# Altium project Smart Motor Switch.PrjPcb
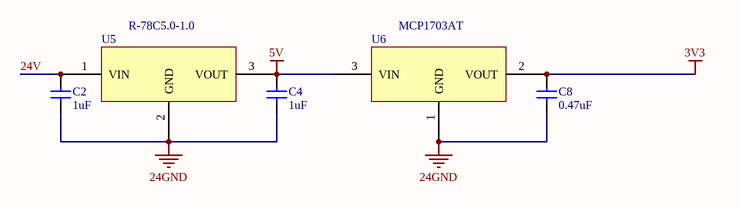
[diagram p0: power.SchDoc]
2 sheets, 53 parts. Net scope: global (net labels, ports and power ports of the same name join across sheets).
Board files: Smart Motor Switch.PcbDoc, SmartMotorSwitch_Panel.PcbDoc
Sheets:
  power.SchDoc
  CPU.SchDoc

## Sheet power.SchDoc
size A

### Parts
C2  value 1uF  [CAPC1206]  (hidden comment: Cap)
C4  value 1uF  [CAPC1206]  (hidden comment: Cap)
C8  value 0.47uF  [CAPC0603]  (hidden comment: Cap)
U5  R-78C5.0-1.0  [R-78C5.0-1.0]
U6  MCP1703AT  [MCP1703AT-xx02EDB]

### Nets
3V3: C8.1(A) U6.2(VOUT)
5V: C4.1(A) U5.3(VOUT) U6.3(VIN)
24GND: C2.2(B) C4.2(B) C8.2(B) U5.2(GND) U6.1(GND)
24V: C2.1(A) U5.1(VIN)

### Library data of the parts
U5 = R-78C5.0-1.0: CONV DC/DC 1A 5V OUT SIP VERT; Supplier 1: Digi-Key; Supplier Part Number 1: 945-1395-5-ND
U6 = MCP1703AT: 250 mA, 16V, Low Quiescent Current LDO Regulator; Supplier 1: Digi-Key; Supplier Part Number 1: MCP1703AT-3302E/CBCT-ND
C2 C4 C8 = Cap: Supplier 1: Digi-Key; Supplier Part Number 1: 1276-1000-1-ND

## Sheet CPU.SchDoc
size A
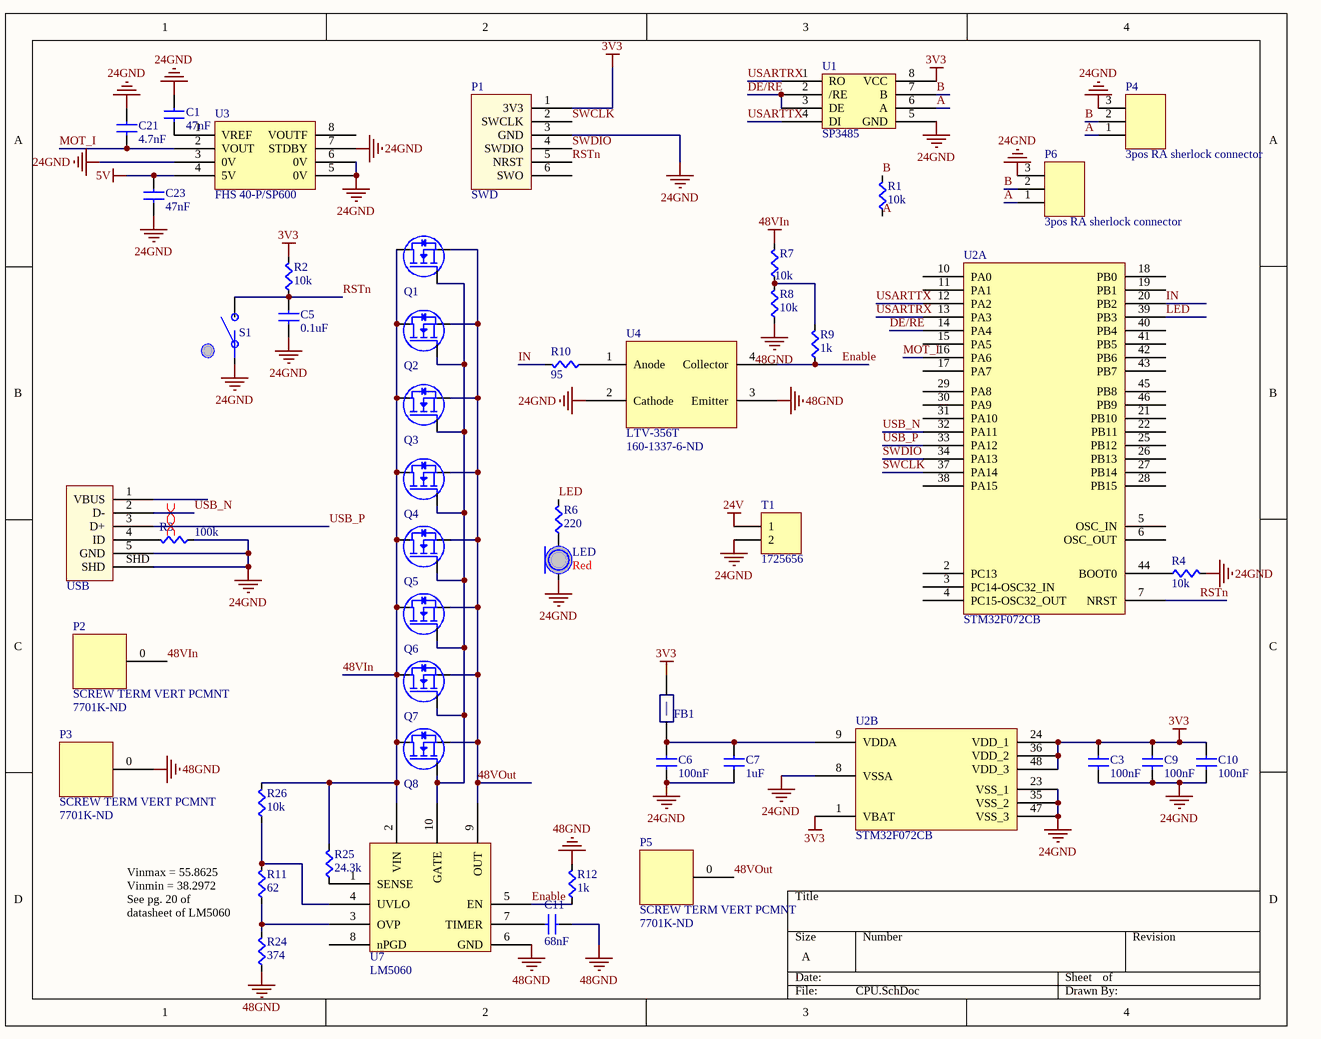
[diagram p1: CPU.SchDoc]

### Parts
C1  value 47nF  [CAPC0603]  (hidden comment: Cap)
C3  value 100nF  [CAPC0603]  (hidden comment: Cap)
C5  value 0.1uF  [CAPC0603]  (hidden comment: Cap)
C6  value 100nF  [CAPC0603]  (hidden comment: Cap)
C7  value 1uF  [CAPC0603]  (hidden comment: Cap)
C9  value 100nF  [CAPC0603]  (hidden comment: Cap)
C10  value 100nF  [CAPC0603]  (hidden comment: Cap)
C11  value 68nF  [CAPC0603]  (hidden comment: Cap)
C21  value 4.7nF  [CAPC0603]  (hidden comment: Cap)
C23  value 47nF  [CAPC0603]  (hidden comment: Cap)
FB1  FBead  [RES0603]  (value not drawn)
LED  Color: Red  [LED0603]  (hidden comment: LED)
P1  SWD  [SWD_STM32]
P2  SCREW TERM VERT PCMNT  Supplier Part Number 1: 7701K-ND  [SCREW TERM SINGLE VERT]
P3  SCREW TERM VERT PCMNT  Supplier Part Number 1: 7701K-ND  [SCREW TERM SINGLE VERT]
P4  3pos RA sherlock connector  [MOLEX-HDR-1X3-SHERLOCK-RA]
P5  SCREW TERM VERT PCMNT  Supplier Part Number 1: 7701K-ND  [SCREW TERM SINGLE VERT]
P6  3pos RA sherlock connector  [MOLEX-HDR-1X3-SHERLOCK-RA]
Q1  CSD19502Q5B  [CSD19502Q5B]  (value not drawn)
Q2  CSD19502Q5B  [CSD19502Q5B]  (value not drawn)
Q3  CSD19502Q5B  [CSD19502Q5B]  (value not drawn)
Q4  CSD19502Q5B  [CSD19502Q5B]  (value not drawn)
Q5  CSD19502Q5B  [CSD19502Q5B]  (value not drawn)
Q6  CSD19502Q5B  [CSD19502Q5B]  (value not drawn)
Q7  CSD19502Q5B  [CSD19502Q5B]  (value not drawn)
Q8  CSD19502Q5B  [CSD19502Q5B]  (value not drawn)
R1  value 10k  [RES0603]  (hidden comment: Res)
R2  value 10k  [RES0603]  (hidden comment: Res)
R3  value 100k  [RES0603]  (hidden comment: Res)
R4  value 10k  [RES0603]  (hidden comment: Res)
R6  value 220  [RES0603]  (hidden comment: Res)
R7  value 10k  [RES0603]  (hidden comment: Res)
R8  value 10k  [RES0603]  (hidden comment: Res)
R9  value 1k  [RES0603]  (hidden comment: Res)
R10  value 95  [RES0603]  (hidden comment: Res)
R11  value 62  [RES0603]  (hidden comment: Res)
R12  value 1k  [RES0603]  (hidden comment: Res)
R24  value 374  [RES0603]  (hidden comment: Res)
R25  value 24.3k  [RES0603]  (hidden comment: Res)
R26  value 10k  [RES0603]  (hidden comment: Res)
S1  Button  [PTS645xxxxSMTR92]  (value not drawn)
T1  1725656  [1725656]
U1  SP3485  [SP3485]
U2  STM32F072CB  [STM32F072CB]  (parts A,B of 2)
U3  FHS 40-P/SP600  [FHS 40-P/SP600]
U4  LTV-356T  Supplier Part Number 1: 160-1337-6-ND  [LTV-356T]
U7  LM5060  [LM5060]
USB  USB Micro  [10118192-0001LF]  (value not drawn)

### Nets
3V3: C3.1(A) C9.1(A) C10.1(A) FB1.2(B) P1.1(3V3) R2.1(A) U1.8(VCC) U2.1(VBAT) U2.24(VDD_1) U2.36(VDD_2) U2.48(VDD_3)
5V: C23.1(A) U3.4(5V)
24GND: C1.1(A) C3.2(B) C5.2(B) C6.2(B) C7.2(B) C9.2(B) C10.2(B) C21.2(B) C23.2(B) LED.C P1.3(GND) P4.3 P6.3 R3.2(B) R4.1(A) S1.A T1.2 U1.5(GND) U2.8(VSSA) U2.23(VSS_1) U2.35(VSS_2) U2.47(VSS_3) U3.3(0V) U3.5(0V) U3.6(0V) U3.7(STDBY) U4.2(Cathode) USB.5(GND) USB.SHD
24V: T1.1
48GND: C11.2(B) P3.0 R8.2(B) R12.1(A) R24.2(B) U4.3(Emitter) U7.6(GND)
48VIn: P2.0 Q1.D Q2.D Q3.D Q4.D Q5.D Q6.D Q7.D Q8.D R7.1(A) R25.1(A) R26.1(A) U7.2(VIN)
48VOut: P5.0 Q1.S Q2.S Q3.S Q4.S Q5.S Q6.S Q7.S Q8.S U7.9(OUT)
A: P4.1 P6.1 R1.2(B) U1.6(A)
B: P4.2 P6.2 R1.1(A) U1.7(B)
DE/RE: U1.2(/RE) U1.3(DE) U2.14(PA4)
Enable: R9.2(B) R12.2(B) U4.4(Collector) U7.5(EN)
IN: R10.1(A) U2.20(PB2)
LED: R6.1(A) U2.39(PB3)
MOT_I: C21.1(A) U2.16(PA6) U3.2(VOUT)
RSTn: C5.1(A) P1.5(NRST) R2.2(B) S1.B U2.7(NRST)
SWCLK: P1.2(SWCLK) U2.37(PA14)
SWDIO: P1.4(SWDIO) U2.34(PA13)
USARTRX: U1.1(RO) U2.13(PA3)
USARTTX: U1.4(DI) U2.12(PA2)
USB_N: U2.32(PA11) USB.2(D-)
USB_P: U2.33(PA12) USB.3(D+)
NetC1_2: C1.2(B) U3.1(VREF)
NetC6_1: C6.1(A) C7.1(A) FB1.1(A) U2.9(VDDA)
NetC11_1: C11.1(A) U7.7(TIMER)
NetLED_A: LED.A R6.2(B)
NetQ1_G: Q1.G Q2.G Q3.G Q4.G Q5.G Q6.G Q7.G Q8.G U7.10(GATE)
NetR3_1: R3.1(A) USB.4(ID)
NetR4_2: R4.2(B) U2.44(BOOT0)
NetR7_2: R7.2(B) R8.1(A) R9.1(A)
NetR10_2: R10.2(B) U4.1(Anode)
NetR11_1: R11.1(A) R26.2(B) U7.4(UVLO)
NetR11_2: R11.2(B) R24.1(A) U7.3(OVP)
NetR25_2: R25.2(B) U7.1(SENSE)

Not connected (* = marked no-connect by the designer): P1 6(SWO); U2 2(PC13) 3(PC14-OSC32_IN) 4(PC15-OSC32_OUT) 5(OSC_IN) 6(OSC_OUT) 10(PA0) 11(PA1) 15(PA5) 17(PA7) 18(PB0) 19(PB1) 21(PB10) 22(PB11) 25(PB12) 26(PB13) 27(PB14) 28(PB15) 29(PA8) 30(PA9) 31(PA10) 38(PA15) 40(PB4) 41(PB5) 42(PB6) 43(PB7) 45(PB8) 46(PB9); U3 8(VOUTF); U7 8(nPGD); USB 1(VBUS)

### Layout directives
differential pair: USB_N, USB_P

### Notes on the sheet
- Vinmax = 55.8625
  Vinmin = 38.2972
  See pg. 20 of datasheet of LM5060

### Library data of the parts
FB1 = FBead: Ferrite Bead; Supplier 1: Digi-Key; Supplier Part Number 1: 445-2988-1-ND
P1 = SWD_STM32: SWD connector matching the pinout on STM Discovery Boards
P2 P3 P5 = SCREW TERM VERT PCMNT: Keystone Electronics 7701; Supplier 1: Digi-Key
P4 P6 = MOLEX-HDR-1x3-SHERLOCK_RA: Header, Molex, 2mm Pitch Sherlock Header, Single Row, Right Angle 3 Circuits, Length 3.3mm; Manufacturer Part Number: 35363-0360; Manufacturer: Molex Connector Corporation; Supplier Part Number 1: WM18932-ND; Supplier 1: Digi-Key
Q1-Q8 = CSD19502Q5B: NEXFET Power MOSFET; Supplier 1: Digi-Key; Supplier Part Number 1: 296-37194-1-ND
S1 = Button: SPST Button; Supplier 1: Digi-Key; Supplier Part Number 1: CKN9087CT-ND
T1 = 1725656: CONN TERM BLOCK 2.54MM 2POS; Supplier 1: Digi-Key; Supplier Part Number 1: 277-1273-ND
U1 = SP3485: IC TXRX RS485 HALF DUPLEX 8NSOIC; Supplier 1: Digi-Key; Supplier Part Number 1: 1016-1817-1-ND
U2 = STM32F072CB: MCU 32BIT 128KB FLASH 48LQFP; Supplier 1: Digi-Key; Supplier Part Number 1: 497-14645-ND
U4 = LTV-356T: OPTOISOLATOR 3.75KV TRANS 4-SOP; Supplier 1: Digi-Key
U7 = LM5060: Hotswap Controller; Supplier 1: Digi-Key; Supplier Part Number 1: LM5060Q1MM/NOPBCT-ND
USB = USB Micro: USB Mini B Metal Shield SMT; Supplier 1: Digi-Key; Supplier Part Number 1: 609-4613-1-ND
C1 C3 C5-C7 C9-C11 C21 C23 = Cap: Supplier 1: Digi-Key; Supplier Part Number 1: 1276-1000-1-ND
LED = LED: Supplier 1: Digi-Key; Supplier Part Number 1: 754-1122-1-ND
R1-R4 R6-R12 R24-R26 = Res: Supplier 1: Digi-Key
  R1-R4 R6-R10 R12 R25 R26: Supplier Part Number 1: RMCF0603JT10K0CT-ND
  R11: Supplier Part Number 1: 311-10.0KLRCT-ND
  R24: Supplier Part Number 1: RHM374CFCT-ND
U3 = FHS 40-P/SP600: Supplier 1: Digi-Key; Supplier Part Number 1: 398-1057-1-ND

## Nets that join several sheets
3V3: power (C8.1 U6.2), CPU (11 pins)
5V: power (C4.1 U5.3 U6.3), CPU (C23.1 U3.4)
24GND: power (5 pins), CPU (29 pins)
24V: power (C2.1 U5.1), CPU (T1.1)